# EAGLE schematic BSPD rev11 (EAGLE 9.6.2)
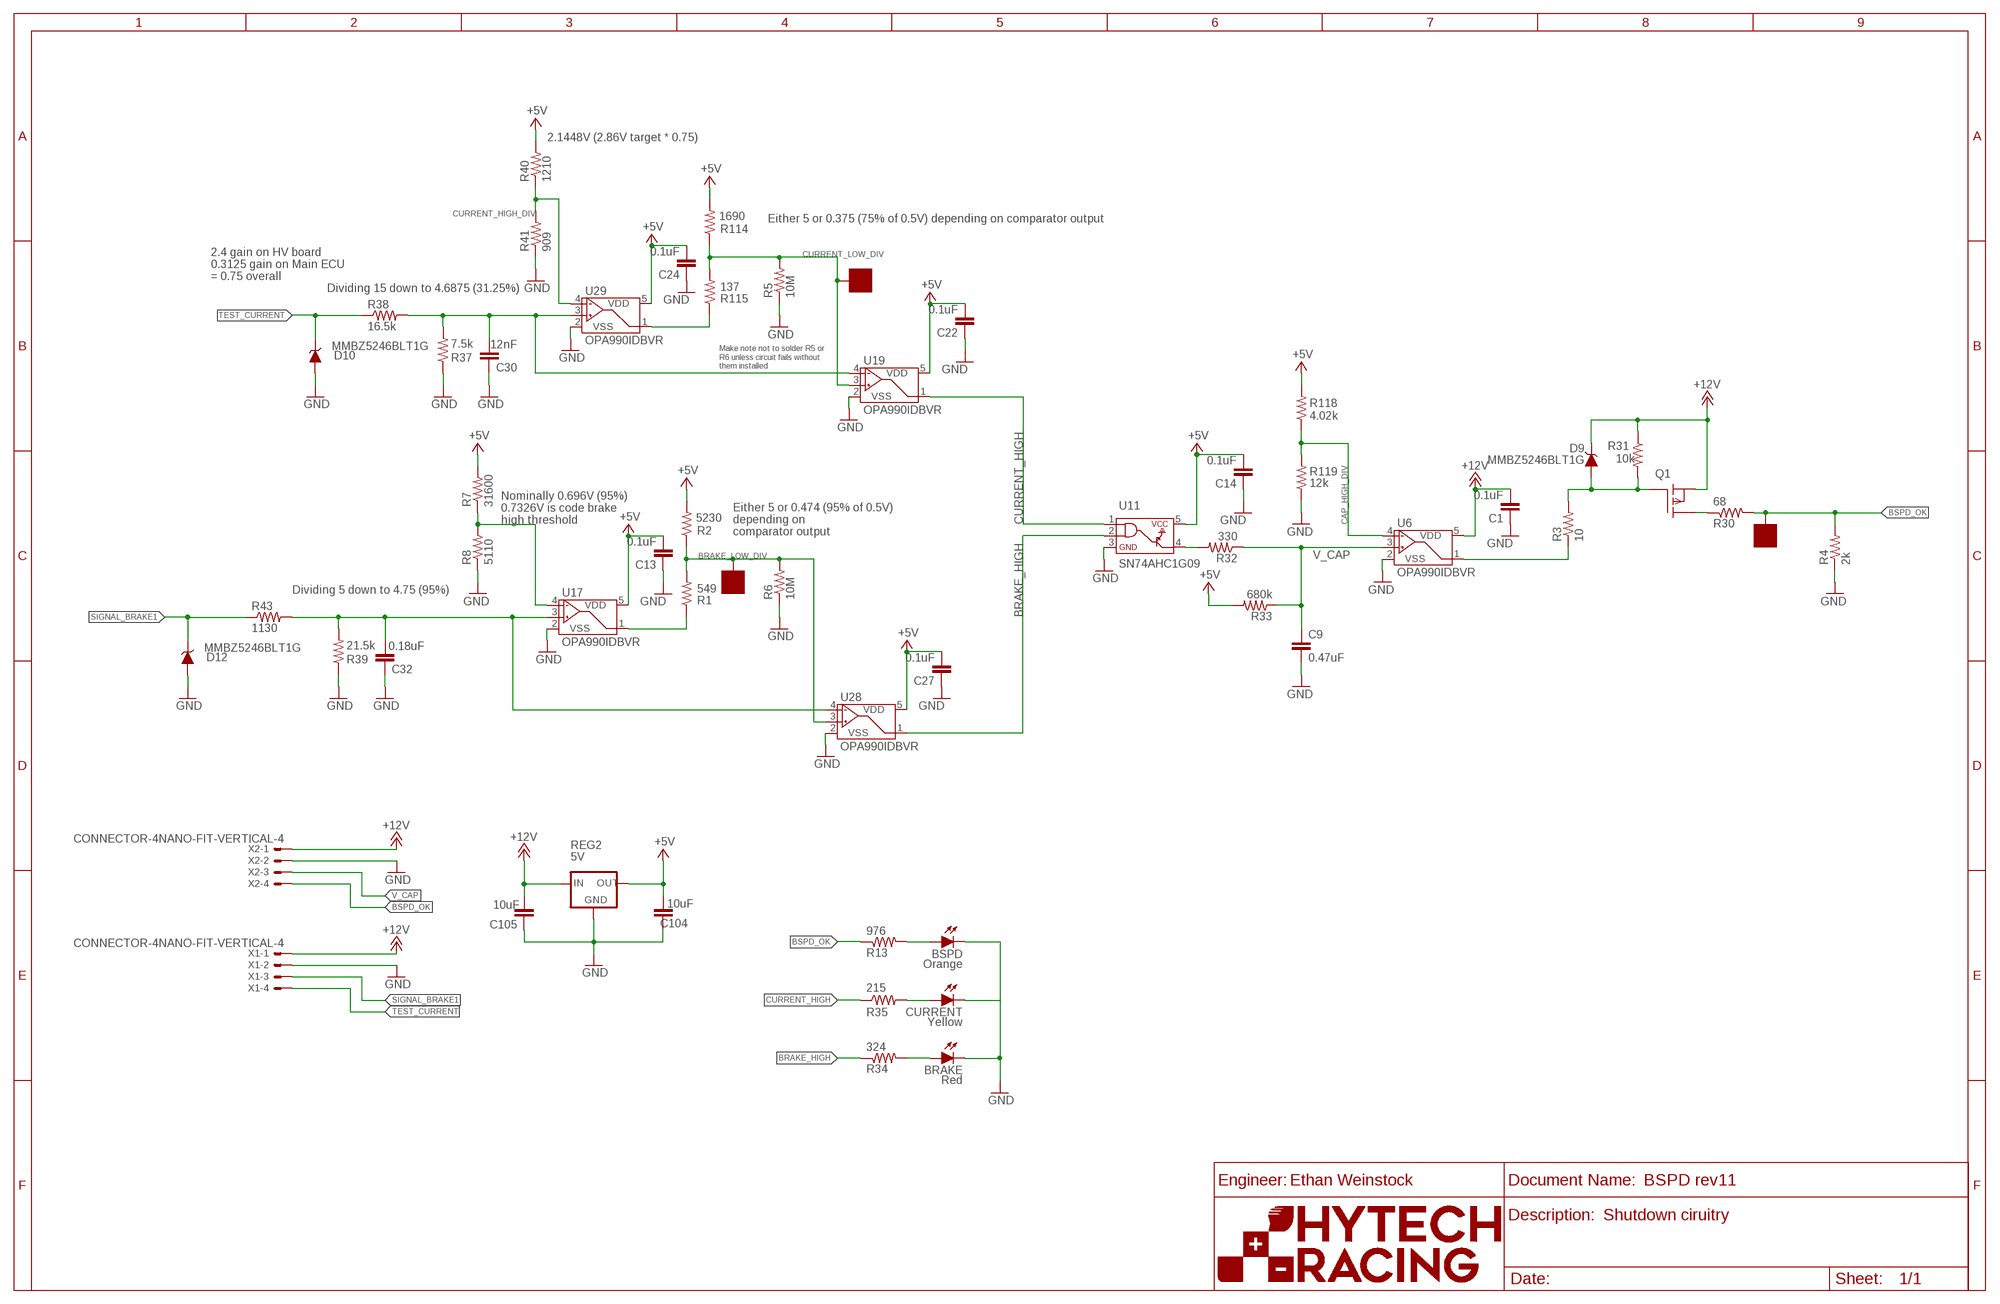
[diagram p0: schematic, sheet 1]
U202 (FRAME_B_L): ORIENTATION: LANDSCAPE; SIZE: B

## Parts
BRAKE  Red  LED-0805  [LED-805]
BSPD  Orange  LED-0805  [LED-805]
C1  0.1uF  CAP0603-CAP  [0603-CAP]
C9  0.47uF  CAP0603-CAP  [0603-CAP]
C13  0.1uF  CAP0603-CAP  [0603-CAP]
C14  0.1uF  CAP0603-CAP  [0603-CAP]
C22  0.1uF  CAP0603-CAP  [0603-CAP]
C24  0.1uF  CAP0603-CAP  [0603-CAP]
C27  0.1uF  CAP0603-CAP  [0603-CAP]
C30  12nF  CAP0603-CAP  [0603-CAP]
C32  0.18uF  CAP0603-CAP  [0603-CAP]
C104  10uF  CAP0603-CAP  [0603-CAP]
C105  10uF  CAP0603-CAP  [0603-CAP]
CURRENT  Yellow  LED-0805  [LED-805]
D9  MMBZ5246BLT1G  DIODE_ZENER  [SOT23]
D10  MMBZ5246BLT1G  DIODE_ZENER  [SOT23]
D12  MMBZ5246BLT1G  DIODE_ZENER  [SOT23]
Q1  P-CHANNEL_MOSFET_DMP3099L-7  [SOT23]
R1  549  RESISTOR0603  [0603-RES]
R2  5230  RESISTOR0603  [0603-RES]
R3  10  RESISTOR0603  [0603-RES]
R4  2k  RESISTOR0603  [0603-RES]
R5  10M  RESISTOR0603  [0603-RES]
R6  10M  RESISTOR0603  [0603-RES]
R7  31600  RESISTOR0603  [0603-RES]
R8  5110  RESISTOR0603  [0603-RES]
R13  976  RESISTOR0603  [0603-RES]
R30  68  RESISTOR0603  [0603-RES]
R31  10k  RESISTOR0603  [0603-RES]
R32  330  RESISTOR0603  [0603-RES]
R33  680k  RESISTOR0603  [0603-RES]
R34  324  RESISTOR0603  [0603-RES]
R35  215  RESISTOR0603  [0603-RES]
R37  7.5k  RESISTOR0603  [0603-RES]
R38  16.5k  RESISTOR0603  [0603-RES]
R39  21.5k  RESISTOR0603  [0603-RES]
R40  1210  RESISTOR0603  [0603-RES]
R41  909  RESISTOR0603  [0603-RES]
R43  1130  RESISTOR0603  [0603-RES]
R114  1690  RESISTOR0603  [0603-RES]
R115  137  RESISTOR0603  [0603-RES]
R118  4.02k  RESISTOR0603  [0603-RES]
R119  12k  RESISTOR0603  [0603-RES]
REG2  5V  OKI-78SR-5  [OKI-78SR]
U6  OPA990IDBVR  [SOT-23-5]
U11  SN74AHC1G09  [SOT-23-5]
U17  OPA990IDBVR  [SOT-23-5]
U19  OPA990IDBVR  [SOT-23-5]
U28  OPA990IDBVR  [SOT-23-5]
U29  OPA990IDBVR  [SOT-23-5]
U$1  SOLDER_PAD  [SOLDER_PAD_XSMALL]
U$2  SOLDER_PAD  [SOLDER_PAD_XSMALL]
U$3  SOLDER_PAD  [SOLDER_PAD_XSMALL]
X1  CONNECTOR-4NANO-FIT-VERTICAL-4  [NANO-FIT_VERTICAL-4]
X2  CONNECTOR-4NANO-FIT-VERTICAL-4  [NANO-FIT_VERTICAL-4]

## Nets
+5V: C13.2 C14.2 C22.2 C24.2 C27.2 C104.2 R2.2 R7.2 R33.2 R40.2 R114.2 R118.2 REG2.3(OUT) U11.5 U17.5(VDD) U19.5(VDD) U28.5(VDD) U29.5(VDD)
+12V: C1.2 C105.2 D9.3(C) Q1.2(S) R31.1 REG2.1(IN) U6.5(VDD) X1.P$1 X2.P$1
BRAKE_HIGH: R34.1 U11.2 U28.1(VOUT)
BRAKE_LOW_DIV: R1.2 R2.1 R6.2 U28.3(VIN+) U$1.P$1
BSPD_OK: R4.2 R13.1 R30.2 U$3.P$1 X2.P$4
CAP_HIGH_DIV: R118.1 R119.2 U6.4(VIN-)
CURRENT_HIGH: R35.1 U11.1 U19.1(VOUT)
CURRENT_HIGH_DIV: R40.1 R41.2 U29.4(VIN-)
CURRENT_LOW_DIV: R5.2 R114.1 R115.2 U19.3(VIN+) U$2.P$1
GND: C1.1 C9.2 C13.1 C14.1 C22.1 C24.1 C27.1 C30.1 C32.1 C104.1 C105.1 D10.1(A) D12.1(A) R4.1 R5.1 R6.1 R8.1 R37.1 R39.1 R41.1 R119.1 REG2.2(GND) U6.2(VSS) U11.3 U17.2(VSS) U19.2(VSS) U28.2(VSS) U29.2(VSS) X1.P$2 X2.P$2
GND1: BRAKE.C BSPD.C CURRENT.C ; supply symbol labelled GND
N$1: Q1.3(D) R30.1
N$3: R1.1 U17.1(VOUT)
N$4: R3.1 U6.1(VOUT)
N$5: C32.2 R39.2 R43.2 U17.3(VIN+) U28.4(VIN-)
N$15: R7.1 R8.2 U17.4(VIN-)
N$19: R115.1 U29.1(VOUT)
N$102: CURRENT.A R35.2
N$103: BRAKE.A R34.2
N$106: C30.2 R37.2 R38.2 U19.4(VIN-) U29.3(VIN+)
N$107: R32.2 U11.4
N$108: BSPD.A R13.2
N$112: D9.1(A) Q1.1(G) R3.2 R31.2
SIGNAL_BRAKE1: D12.3(C) R43.1 X1.P$3
TEST_CURRENT: D10.3(C) R38.1 X1.P$4
V_CAP: C9.1 R32.1 R33.1 U6.3(VIN+) X2.P$3

## Notes on the sheet
- 2.1448V (2.86V target * 0.75)
- Either 5 or 0.375 (75% of 0.5V) depending on comparator output
- 2.4 gain on HV board
  0.3125 gain on Main ECU
  = 0.75 overall
- Dividing 15 down to 4.6875 (31.25%)
- Make note not to solder R5 or 
  R6 unless circuit fails without
  them installed
- Nominally 0.696V (95%)
  0.7326V is code brake
  high threshold
- Either 5 or 0.474 (95% of 0.5V)
  depending on
  comparator output
- Dividing 5 down to 4.75 (95%)
- Ethan Weinstock
- Shutdown ciruitry

## Library data of the parts
BRAKE BSPD CURRENT = HyTechDevices:LED: Light Emitting Diode (LED) Source: Dangerous Prototypes Eagle Library <https://github.com/DangerousPrototypes/Eagle_Part_Library>
C1 C9 C13 C14 C22 C24 C27 C30 C32 C104 C105 = HyTechDevices:CAP: Capacitor Standard 0603 ceramic capacitor, and 0.1" leaded capacitor.
D9 D10 D12 = HyTechDevices:DIODE_ZENER: ZENER DIODE
Q1 = HyTechDevices:P-CHANNEL_MOSFET_DMP3099L-7: Diodes Incorporated P-Channel Enhancement Mode MOSFET Datasheet <http://www.mouser.com/ds/2/115/DMP3099L-266220.pdf>
R1-R8 R13 R30-R35 R37-R41 R43 R114 R115 R118 R119 = HyTechDevices:RESISTOR: Resistor Basic schematic elements and footprints for 0603, 1206, and PTH resistors.
REG2 = HyTechDevices:OKI-78SR-5: Murata OKI-78SR 5V 1.5A Non-Isolated Switching Regulator DC/DC - Datasheet <https://power.murata.com/data/power/oki-78sr.pdf>
U6 U17 U19 U28 U29 = HyTechDevices:OPA990IDBVR: TI OPA990 20V Op-Amp Comparator Datasheet <https://www.ti.com/lit/ds/symlink/opa990.pdf>
U11 = HyTechDevices:SN74AHC1G09: TI SN74AHC1G09 Single 2–Input Positive-AND Gate With Open-Drain Output Datasheet <http://www.ti.com/lit/ds/symlink/sn74ahc1g09.pdf>
U$1-U$3 = HyTechDevices:SOLDER_PAD: Solder pad used to attach wires directly to PCB
X1 X2 = HyTechDevices:CONNECTOR-4: Mini-Fit Junior connector 4 pole Source: http://www.molex.com